# Altium schematic sheet headers.SchDoc: Headers
size B; Engineer: Jacob Faucett; Organization: CUAir; Address1: L3, 12a Rodborough Rd; Address2: Frenchs Forest; Address3: NSW; Address4: Australia 2086; Revision: 1; SheetNumber: 3; SheetTotal: 9; CompetitionYear: 2025; CPN: N/A; PROJECT: Current Logging and Validation Board
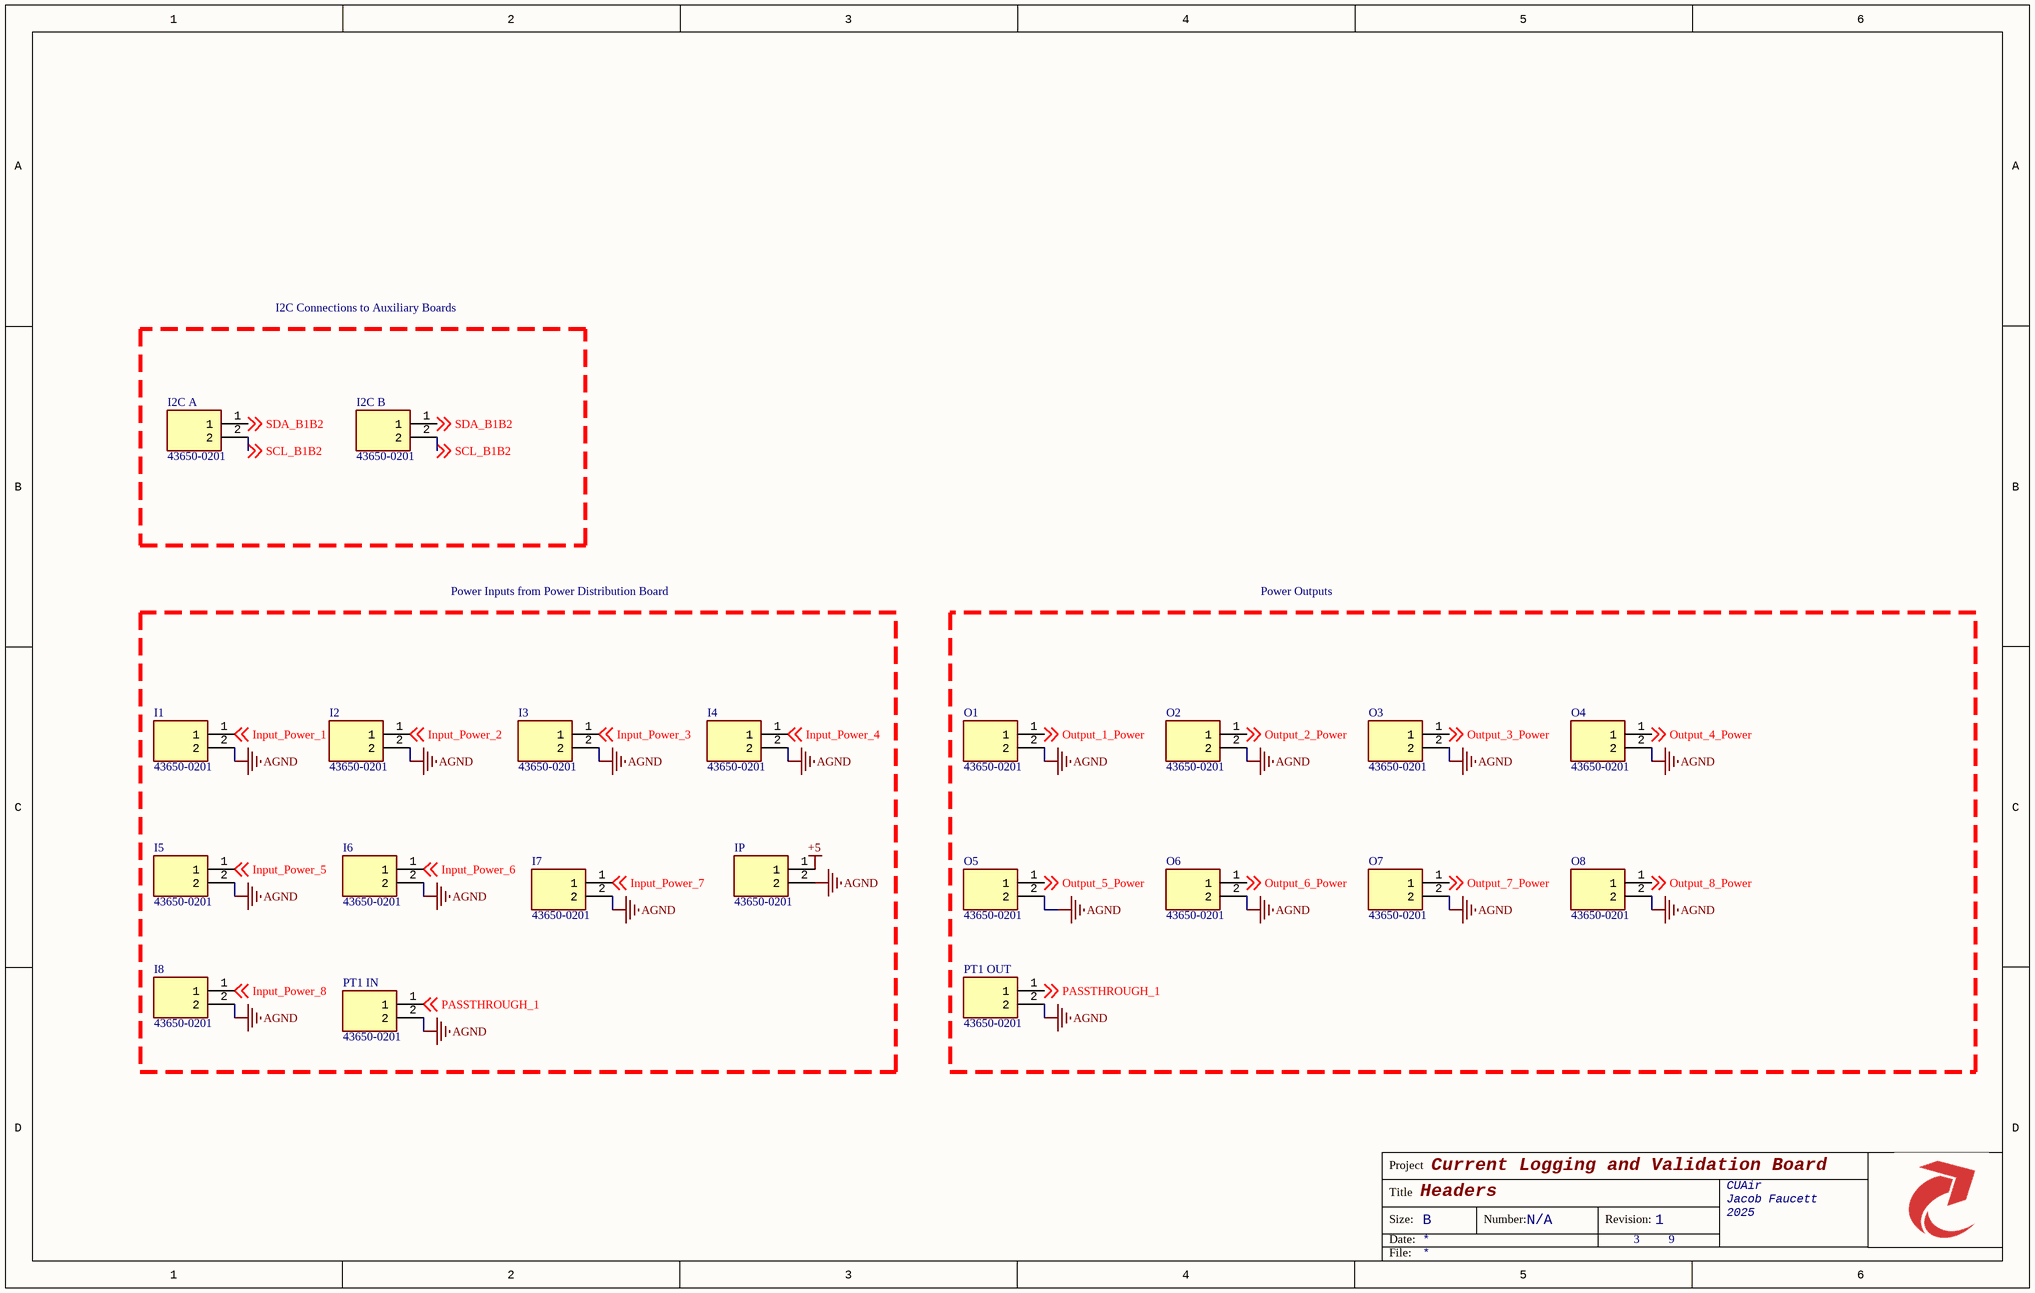
[diagram p0: headers.SchDoc]

## Parts
I1  43650-0201  [43650-02(00,01,02)]
I2  43650-0201  [43650-02(00,01,02)]
I2C_A  43650-0201  [43650-02(00,01,02)]
I2C_B  43650-0201  [43650-02(00,01,02)]
I3  43650-0201  [43650-02(00,01,02)]
I4  43650-0201  [43650-02(00,01,02)]
I5  43650-0201  [43650-02(00,01,02)]
I6  43650-0201  [43650-02(00,01,02)]
I7  43650-0201  [43650-02(00,01,02)]
I8  43650-0201  [43650-02(00,01,02)]
IP  43650-0201  [43650-02(00,01,02)]
O1  43650-0201  [43650-02(00,01,02)]
O2  43650-0201  [43650-02(00,01,02)]
O3  43650-0201  [43650-02(00,01,02)]
O4  43650-0201  [43650-02(00,01,02)]
O5  43650-0201  [43650-02(00,01,02)]
O6  43650-0201  [43650-02(00,01,02)]
O7  43650-0201  [43650-02(00,01,02)]
O8  43650-0201  [43650-02(00,01,02)]
PT1_IN  43650-0201  [43650-02(00,01,02)]
PT1_OUT  43650-0201  [43650-02(00,01,02)]

## Blocks framed on the sheet
I2C Connections to Auxiliary Boards: I2C_A I2C_B
Power Inputs from Power Distribution Board: I1-I8 IP PT1_IN
Power Outputs: O1-O8 PT1_OUT

## Nets
+5: IP.1
AGND: I1.2 I2.2 I3.2 I4.2 I5.2 I6.2 I7.2 I8.2 IP.2 O1.2 O2.2 O3.2 O4.2 O5.2 O6.2 O7.2 O8.2 PT1_IN.2 PT1_OUT.2
Input_Power_1: I1.1 ; off-sheet Input_Power_1
Input_Power_2: I2.1 ; off-sheet Input_Power_2
Input_Power_3: I3.1 ; off-sheet Input_Power_3
Input_Power_4: I4.1 ; off-sheet Input_Power_4
Input_Power_5: I5.1 ; off-sheet Input_Power_5
Input_Power_6: I6.1 ; off-sheet Input_Power_6
Input_Power_7: I7.1 ; off-sheet Input_Power_7
Input_Power_8: I8.1 ; off-sheet Input_Power_8
Output_1_Power: O1.1 ; off-sheet Output_1_Power
Output_2_Power: O2.1 ; off-sheet Output_2_Power
Output_3_Power: O3.1 ; off-sheet Output_3_Power
Output_4_Power: O4.1 ; off-sheet Output_4_Power
Output_5_Power: O5.1 ; off-sheet Output_5_Power
Output_6_Power: O6.1 ; off-sheet Output_6_Power
Output_7_Power: O7.1 ; off-sheet Output_7_Power
Output_8_Power: O8.1 ; off-sheet Output_8_Power
PASSTHROUGH_1: PT1_IN.1 PT1_OUT.1 ; off-sheet PASSTHROUGH_1
SCL_B1B2: I2C_A.2 I2C_B.2 ; off-sheet SCL_B1B2
SDA_B1B2: I2C_A.1 I2C_B.1 ; off-sheet SDA_B1B2

## Notes on the sheet
- Project
- Title
- Size:
- Date:
- B
- Number:
- Revision:
- File:

## Library data of the parts
I1 I2 I2C_A I2C_B I3-I8 IP O1-O8 PT1_IN PT1_OUT = CMP-002-00072-2: Connector; Manufacturer_Name: Molex; Design Item ID: 43650-0201; Source: 1x2 Right Angle Molex Microfit.SchLib; Mouser Price/Stock: https://www.mouser.co.uk/ProductDetail/Molex/43650-0201?qs=HlEFOAM0q6XDqOKWr68Eiw%3D%3D; Height: 5.57mm; Manufacturer_Part_Number: 43650-0201; Mouser Part Number: 538-43650-0201; Datasheet Link: https://www.molex.com/pdm_docs/sd/436500200_sd.pdf